# EAGLE design coil-driver-2 (EAGLE 4.16)
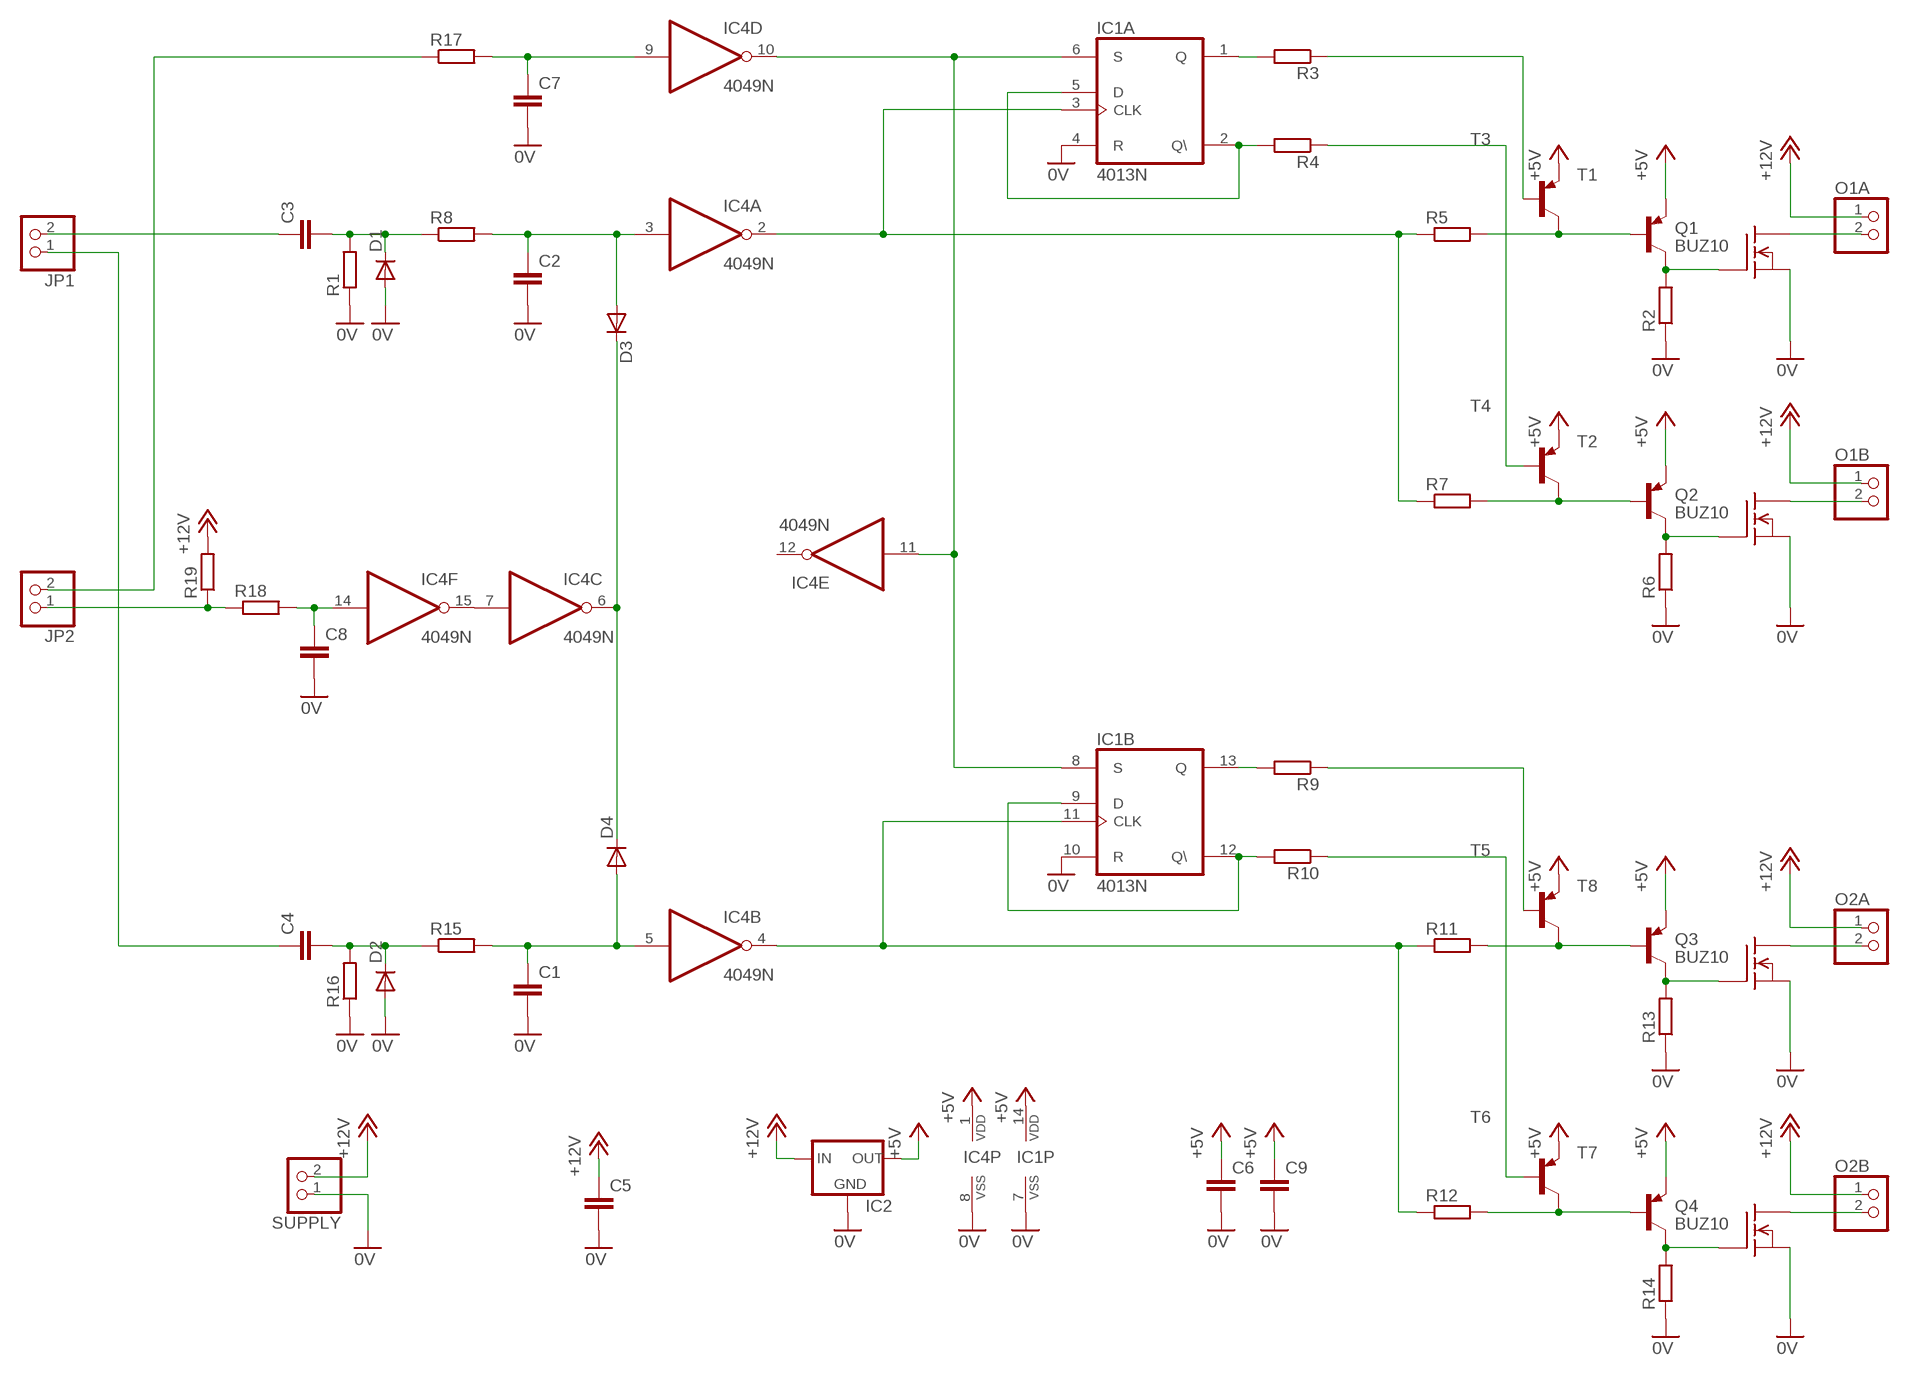
[diagram p0: schematic, sheet 1]

## Parts
C1  C-EU050-030X075  [C050-030X075]
C2  C-EU050-030X075  [C050-030X075]
C3  C-EU050-030X075  [C050-030X075]
C4  C-EU050-030X075  [C050-030X075]
C5  C-EU050-030X075  [C050-030X075]
C6  C-EU050-030X075  [C050-030X075]
C7  C-EU050-030X075  [C050-030X075]
C8  C-EU050-030X075  [C050-030X075]
C9  C-EU050-030X075  [C050-030X075]
D1  DIODE-D-7.5  [D-7.5]
D2  DIODE-D-7.5  [D-7.5]
D3  DIODE-D-7.5  [D-7.5]
D4  DIODE-D-7.5  [D-7.5]
IC1  4013N  [DIL14]
IC2  78XXL  [78XXL]
IC4  4049N  [DIL16]
JP1  PINHD-1X2  [1X02]
JP2  PINHD-1X2  [1X02]
O1A  PINHD-1X2  [1X02]
O1B  PINHD-1X2  [1X02]
O2A  PINHD-1X2  [1X02]
O2B  PINHD-1X2  [1X02]
Q1  BUZ10  [TO220]
Q2  BUZ10  [TO220]
Q3  BUZ10  [TO220]
Q4  BUZ10  [TO220]
R1  R-EU_0207/7  [0207/7]
R2  R-EU_0207/7  [0207/7]
R3  R-EU_0207/7  [0207/7]
R4  R-EU_0207/7  [0207/7]
R5  R-EU_0207/7  [0207/7]
R6  R-EU_0207/7  [0207/7]
R7  R-EU_0207/7  [0207/7]
R8  R-EU_0207/7  [0207/7]
R9  R-EU_0207/7  [0207/7]
R10  R-EU_0207/7  [0207/7]
R11  R-EU_0207/7  [0207/7]
R12  R-EU_0207/7  [0207/7]
R13  R-EU_0207/7  [0207/7]
R14  R-EU_0207/7  [0207/7]
R15  R-EU_0207/7  [0207/7]
R16  R-EU_0207/7  [0207/7]
R17  R-EU_0207/7  [0207/7]
R18  R-EU_0207/7  [0207/7]
R19  R-EU_0207/7  [0207/7]
SUPPLY  PINHD-1X2  [1X02]
T1  BC557B-PNP-TO92-EBC  [TO92-EBC]
T2  BC557B-PNP-TO92-EBC  [TO92-EBC]
T3  BC557B-PNP-TO92-EBC  [TO92-EBC]
T4  BC557B-PNP-TO92-EBC  [TO92-EBC]
T5  BC557B-PNP-TO92-EBC  [TO92-EBC]
T6  BC557B-PNP-TO92-EBC  [TO92-EBC]
T7  BC557B-PNP-TO92-EBC  [TO92-EBC]
T8  BC557B-PNP-TO92-EBC  [TO92-EBC]

## Nets
0V: C1.2 C2.2 C5.2 C6.2 C7.2 C8.2 C9.2 D1.A D2.A IC1.4(A:R) IC1.7(P:VSS) IC1.10(B:R) IC2.GND IC4.8(P:VSS) Q1.3(S) Q2.3(S) Q3.3(S) Q4.3(S) R1.1 R2.1 R6.1 R13.1 R14.1 R16.1 SUPPLY.1
+5V: C6.1 C9.1 IC1.14(P:VDD) IC2.OUT IC4.1(P:VDD) T1.E T2.E T3.E T4.E T5.E T6.E T7.E T8.E
+12V: C5.1 IC2.IN O1A.1 O1B.1 O2A.1 O2B.1 R19.2 SUPPLY.2
N$1: Q1.1(G) R2.2 T1.C
N$2: O1A.2 Q1.2(D)
N$3: IC1.1(A:Q) R3.2
N$4: IC1.2(A:Q\) IC1.5(A:D) R4.2
N$5: R3.1 T3.B
N$6: IC1.3(A:CLK) IC4.2(A:O) R5.1 R7.1
N$7: O1B.2 Q2.2(D)
N$8: C2.1 D3.A IC4.3(A:I) R8.2
N$9: Q2.1(G) R6.2 T2.C
N$10: R4.1 T4.B
N$11: R5.2 T1.B T3.C
N$12: IC1.11(B:CLK) IC4.4(B:O) R11.1 R12.1
N$13: IC1.13(B:Q) R9.2
N$14: R7.2 T2.B T4.C
N$15: C3.2 D1.C R1.2 R8.1
N$16: IC1.9(B:D) IC1.12(B:Q\) R10.2
N$17: R9.1 T5.B
N$18: R10.1 T6.B
N$19: Q3.1(G) R13.2 T8.C
N$20: R11.2 T5.C T8.B
N$21: R12.2 T6.C T7.B
N$22: Q4.1(G) R14.2 T7.C
N$23: O2B.2 Q4.2(D)
N$24: O2A.2 Q3.2(D)
N$25: C4.2 D2.C R15.1 R16.2
N$26: C1.1 D4.A IC4.5(B:I) R15.2
N$27: C4.1 JP1.1
N$28: C3.1 JP1.2
N$29: IC1.6(A:S) IC1.8(B:S) IC4.10(D:O) IC4.11(E:I)
N$30: C7.1 IC4.9(D:I) R17.2
N$32: JP2.2 R17.1
N$37: IC4.7(C:I) IC4.15(F:O)
N$38: JP2.1 R18.1 R19.1
N$39: C8.1 IC4.14(F:I) R18.2
N$40: D3.C D4.C IC4.6(C:O)
Unconnected: IC4.12(E:O)

## Library data of the parts
C1-C9 = rcl:C-EU: CAPACITOR, European symbol
D1-D4 = diode:DIODE-: DIODE
IC1 = 40xx:4013: Dual D FLIP FLOP, set/reset
IC2 = v-reg:78XXL: VOLTAGE REGULATOR
IC4 = 40xx:4049: Hex inverting BUFFER
JP1 JP2 O1A O1B O2A O2B SUPPLY = pinhead:PINHD-1X2: PIN HEADER
Q1-Q4 = transistor-fet:BUZ10: N-Channel Enhancement MOSFET 50V; 20A; 0,080Ohm
R1-R19 = rcl:R-EU_: RESISTOR, European symbol
T1-T8 = transistor:*-PNP-: PNP Transistror

## Board
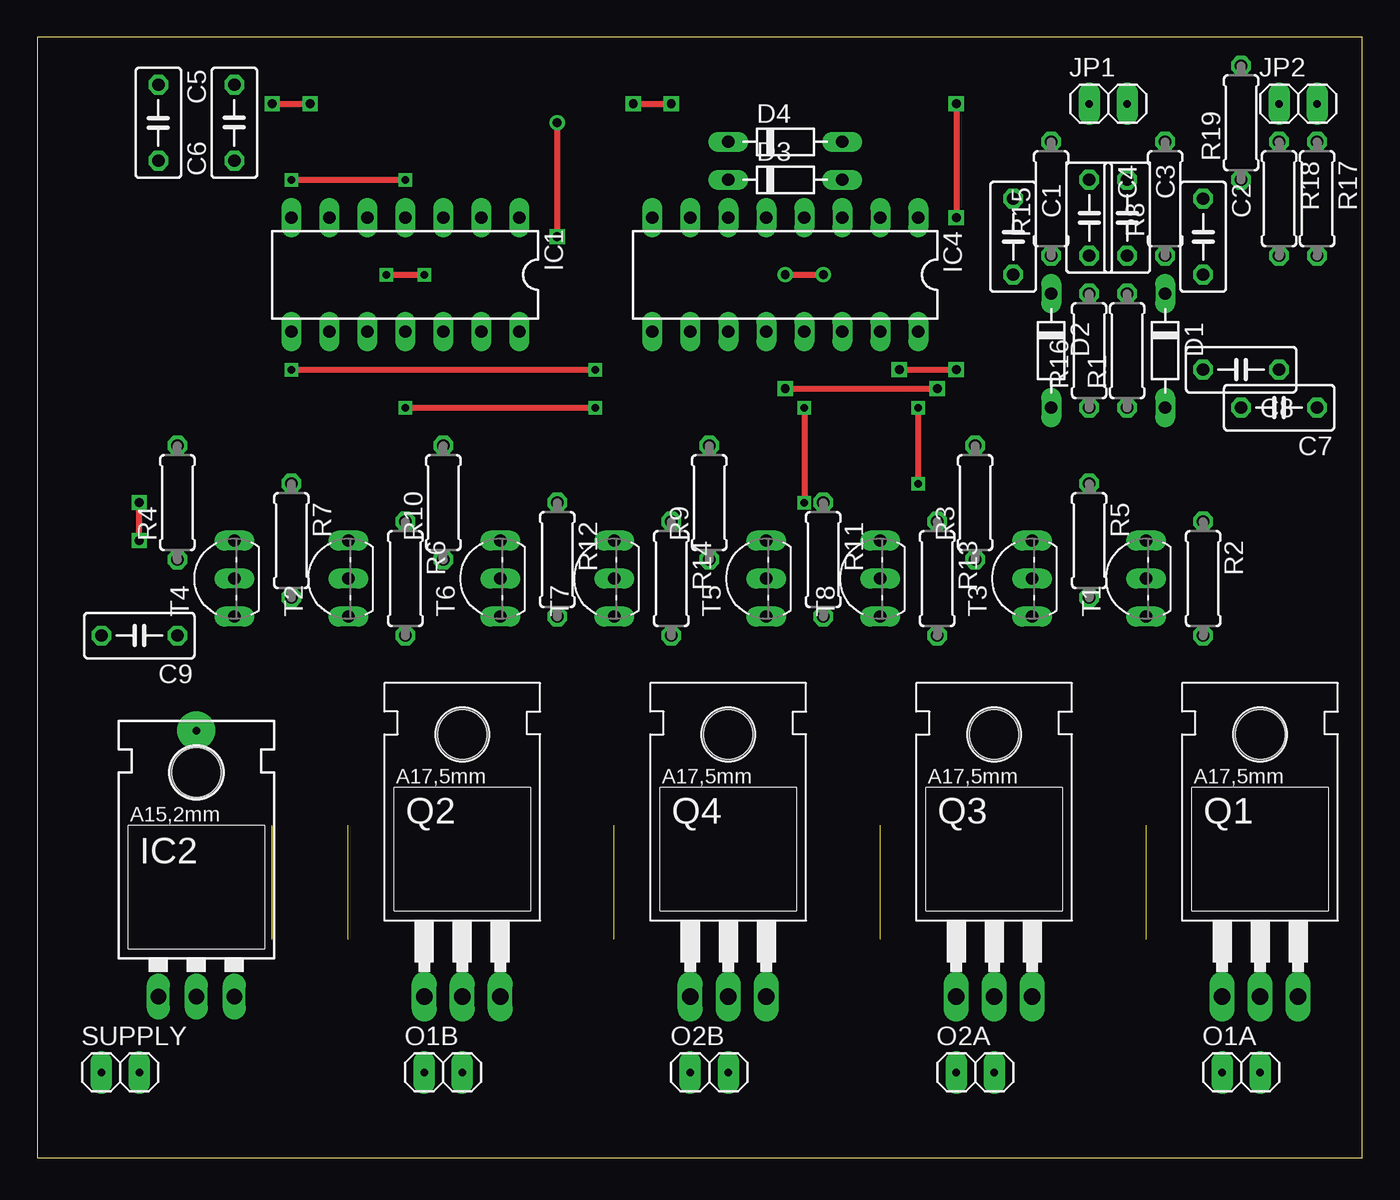
[diagram p1: board, top side]
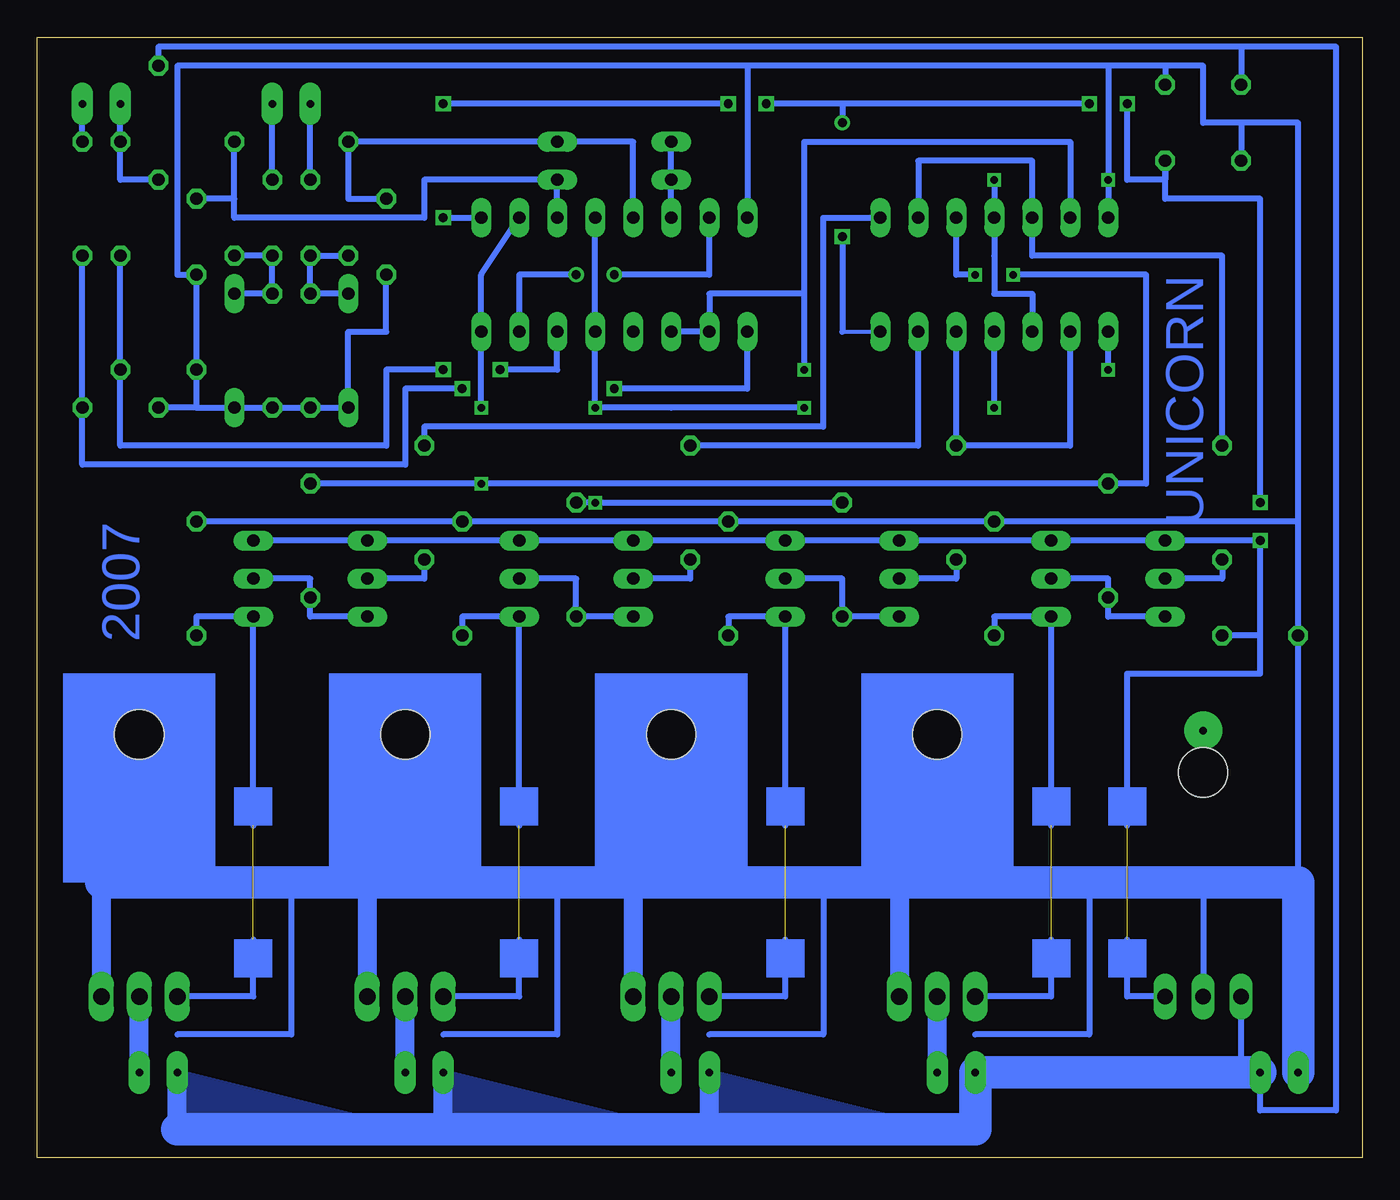
[diagram p2: board, bottom side, seen from below]

Size 88.57 x 74.92 mm. Coordinates in mm from the lower left corner, seen from the top.
Outline: 0,0 88.57,0 88.57,74.92 0,74.92 0,0
Copper layers (1*16): Top 0.035mm / dielectric 1.5mm / Bottom 0.035mm
Design rules "default": minimum track width 10mil, minimum drill 24mil, track to track 8mil, track to pad 8mil, pad to pad 8mil, via to via 8mil, smd to smd 8mil, copper to edge 40mil, drill to drill 8mil, minimum pad ring 10mil, minimum via ring 8mil, stop-mask expansion 4mil, vias tented up to drill 0mil, thermal gap 10mil

### Footprints (pad centres in the part's own frame; a part is rotated, then mirrored left to right if it is on the bottom)
C050-030X075 = drill 0.813 octagon: 1 -2.54,0; 2 2.54,0
D-7.5 = drill 0.813 long: A 3.81,0; C -3.81,0
DIL14 = drill 0.813 long: 1 -7.62,-3.81; 2 -5.08,-3.81; 3 -2.54,-3.81; 4 0,-3.81; 5 2.54,-3.81; 6 5.08,-3.81; 7 7.62,-3.81; 8 7.62,3.81; 9 5.08,3.81; 10 2.54,3.81; 11 0,3.81; 12 -2.54,3.81; 13 -5.08,3.81; 14 -7.62,3.81
78XXL = drill 1.016 long: GND 0,-3.81; IN -2.54,-3.81; OUT 2.54,-3.81 | hole 3.302: 0,11.176
DIL16 = drill 0.813 long: 1 -8.89,-3.81; 2 -6.35,-3.81; 3 -3.81,-3.81; 4 -1.27,-3.81; 5 1.27,-3.81; 6 3.81,-3.81; 7 6.35,-3.81; 8 8.89,-3.81; 9 8.89,3.81; 10 6.35,3.81; 11 3.81,3.81; 12 1.27,3.81; 13 -1.27,3.81; 14 -3.81,3.81; 15 -6.35,3.81; 16 -8.89,3.81
1X02 = drill 0.5 pad 1.422 long: 1 -1.27,0; 2 1.27,0
TO220 = drill 1.118 long: 1 -2.54,-6.35; 2 0,-6.35; 3 2.54,-6.35 | hole 3.302: 0,11.176
0207/7 = drill 0.813 octagon: 1 -3.81,0; 2 3.81,0
TO92-EBC = drill 0.813 long: B 0,-1.27; C -2.54,-1.27; E 2.54,-1.27

### Placement (x,y rotation side)
C1  65.24,61.59 270 top
C2  77.94,61.59 270 top
C3  72.86,62.86 270 top
C4  70.32,62.86 270 top
C5  8.09,69.21 270 top
C6  13.17,69.21 90 top
C7  83.02,50.16 180 top
C8  80.48,52.7 180 top
C9  6.82,34.92 180 top
D1  75.4,53.97 270 top
D2  67.78,53.97 270 top
D3  50,65.4 0 top
D4  50,67.94 0 top
IC1  24.6,59.05 180 top
IC2  10.63,14.6 0 top
IC4  50,59.05 180 top
JP1  71.59,70.48 0 top
JP2  84.29,70.48 0 top
O1A  80.48,5.71 0 top
O1B  27.14,5.71 0 top
O2A  62.7,5.71 0 top
O2B  44.92,5.71 0 top
Q1  81.75,17.14 0 top
Q2  28.41,17.14 0 top
Q3  63.97,17.14 0 top
Q4  46.19,17.14 0 top
R1  72.86,53.97 90 top
R2  77.94,38.73 270 top
R3  62.7,43.81 90 top
R4  9.36,43.81 90 top
R5  70.32,41.27 270 top
R6  24.6,38.73 270 top
R7  16.98,41.27 270 top
R8  75.4,64.13 90 top
R9  44.92,43.81 90 top
R10  27.14,43.81 90 top
R11  52.54,40 270 top
R12  34.76,40 270 top
R13  60.16,38.73 270 top
R14  42.38,38.73 270 top
R15  67.78,64.13 90 top
R16  70.32,53.97 90 top
R17  85.56,64.13 270 top
R18  83.02,64.13 270 top
R19  80.48,69.21 90 top
SUPPLY  5.55,5.71 0 top
T1  72.86,38.73 90 top
T2  19.52,38.73 90 top
T3  65.24,38.73 90 top
T4  11.9,38.73 90 top
T5  47.46,38.73 90 top
T6  29.68,38.73 90 top
T7  37.3,38.73 90 top
T8  55.08,38.73 90 top

### Tracks (layer width: path | path; a pad name or v marks a point on that pad's centre or on a via)
0V  (via drill 0.5)
  Top 0.406: v16.98,65.4 v24.6,65.4
  Bottom 0.406: R2.1 R13.1 R14.1 R6.1 4.28,42.54 | 10.63,18.41 IC2.GND | 16.98,73.02 v16.98,65.4 IC1.7 | 41.11,73.02 IC4.8 | 16.98,73.02 41.11,73.02 | v24.6,65.4 IC1.4 24.6,60.32 24.6,57.78 22.06,57.78 IC1.10 | C1.2 65.24,55.24 67.78,55.24 D2.A R16.1 R1.1 D1.A 77.94,50.16 | C8.2 77.94,50.16 | C2.2 C8.2 | 43.65,8.25 36.03,8.25 36.03,18.41 | 61.43,8.25 53.81,8.25 53.81,18.41 | 79.21,8.25 71.59,8.25 71.59,18.41 | 25.87,8.25 18.25,8.25 18.25,18.41 | C2.2 C8.2 | 8.09,69.21 4.28,69.21 4.28,42.54 | 8.09,69.21 10.63,69.21 10.63,73.02 13.17,73.02 | 4.28,18.41 C9.2 | C9.2 4.28,42.54 | 77.94,50.16 C7.2 | C2.2 77.94,50.16 | C2.2 79.21,59.05 79.21,73.02 41.11,73.02 | 13.17,73.02 C6.2 | 13.17,73.02 16.98,73.02 | SUPPLY.1 C9.2 | 8.09,69.21 C5.2
  Bottom 1.27: 84.29,18.41 Q1.3 | 30.95,18.41 Q2.3 | 48.73,18.41 Q4.3 | 66.51,18.41 Q3.3
  Bottom 2.184: SUPPLY.1 4.28,18.41 10.63,18.41 18.25,18.41 30.95,18.41 36.03,18.41 48.73,18.41 53.81,18.41 66.51,18.41 71.59,18.41 84.29,18.41
+5V  (via drill 0.6)  (1 unrouted)
  Top 0.406: v61.43,70.48 v61.43,62.86 | v39.84,70.48 v42.38,70.48 | v34.76,69.21 v34.76,61.59 | v15.71,70.48 v18.25,70.48 | v6.82,41.27 v6.82,43.81
  Bottom 0.254: 34.76,55.24 IC1.14
  Bottom 0.406: T1.E T3.E T8.E T5.E T7.E T6.E T2.E T4.E v6.82,41.27 6.82,34.92 | v61.43,62.86 IC4.1 | IC2.OUT 15.71,10.79 15.71,14.6 | 15.71,22.22 15.71,32.38 6.82,32.38 6.82,34.92 | v42.38,70.48 v61.43,70.48 | 34.76,70.48 v39.84,70.48 | v34.76,61.59 34.76,55.24 | 34.76,70.48 v34.76,69.21 | v18.25,70.48 34.76,70.48 | v15.71,70.48 15.71,65.4 13.17,65.4 C6.1 13.17,64.13 6.82,64.13 v6.82,43.81 | 6.82,34.92 C9.1
+12V
  Bottom 0.406: 8.09,5.71 IC2.IN | SUPPLY.2 6.82,3.17 1.74,3.17 1.74,74.29 8.09,74.29 | 8.09,74.29 80.48,74.29 R19.2 | 8.09,74.29 C5.1
  Bottom 1.27: 43.65,1.9 O2B.1 | 61.43,1.9 O2A.1 | 79.21,1.9 O1A.1
  Bottom 2.184: SUPPLY.2 8.09,5.71 O1B.1 25.87,1.9 43.65,1.9 61.43,1.9 79.21,1.9
  pour Bottom (no thermals): 28.41,1.9 43.65,5.71 43.65,1.9
  pour Bottom (no thermals): 63.97,1.9 79.21,5.71 79.21,1.9
  pour Bottom (no thermals): 46.19,1.9 61.43,5.71 61.43,1.9
N$1  (1 unrouted)
  Bottom 0.406: 74.13,22.22 T1.C 77.94,36.19 R2.2 | Q1.1 74.13,10.79 74.13,14.6
N$2
  Bottom 1.27: O1A.2 Q1.2
N$3
  Bottom 0.406: R3.2 62.7,48.89 36.03,48.89 36.03,62.86 IC1.1
N$4
  Bottom 0.406: R4.2 9.36,60.32 22.06,60.32 IC1.5 22.06,66.67 29.68,66.67 IC1.2
N$5
  Bottom 0.406: T3.B 62.7,38.73 R3.1
N$6  (via drill 0.5)
  Top 0.406: v58.89,45.08 v58.89,50.16 | v23.33,59.05 v25.87,59.05
  Bottom 0.406: R5.1 v58.89,45.08 R7.1 14.44,45.08 14.44,59.05 v23.33,59.05 | IC1.3 27.14,59.05 v25.87,59.05 | IC4.2 58.89,59.05 v58.89,50.16
N$7
  Bottom 1.27: O1B.2 Q2.2
N$8
  Bottom 0.406: IC4.3 D3.A 62.7,65.4 62.7,62.86 75.4,62.86 75.4,64.13 | 75.4,64.13 R8.2 | 75.4,64.13 C2.1
N$9  (1 unrouted)
  Bottom 0.406: 20.79,22.22 T2.C 24.6,36.19 R6.2 | Q2.1 20.79,10.79 20.79,14.6
N$10
  Bottom 0.406: T4.B 9.36,38.73 R4.1
N$11
  Bottom 0.406: T3.C 70.32,36.19 R5.2 70.32,38.73 T1.B
N$12  (via drill 0.5)
  Top 0.406: v51.27,50.16 v51.27,43.81 | v24.6,50.16 v37.3,50.16
  Bottom 0.406: R12.1 v51.27,43.81 R11.1 | v24.6,50.16 IC1.11 | v37.3,50.16 46.19,50.16 v51.27,50.16 IC4.4
N$13
  Bottom 0.406: R9.2 29.68,47.62 IC1.13
N$14
  Bottom 0.406: T4.C 16.98,36.19 R7.2 16.98,38.73 T2.B
N$15
  Bottom 0.406: D1.C R1.2 C3.2 R8.1
N$16
  Bottom 0.406: IC1.9 19.52,47.62 R10.2 IC1.12
N$17
  Bottom 0.406: T5.B 44.92,38.73 R9.1
N$18
  Bottom 0.406: R10.1 27.14,38.73 T6.B
N$19  (1 unrouted)
  Bottom 0.406: 56.35,22.22 T8.C 60.16,36.19 R13.2 | Q3.1 56.35,10.79 56.35,14.6
N$20
  Bottom 0.406: T5.C R11.2 52.54,38.73 T8.B
N$21
  Bottom 0.406: T6.C R12.2 34.76,38.73 T7.B
N$22  (1 unrouted)
  Bottom 0.406: 38.57,22.22 T7.C 42.38,36.19 R14.2 | Q4.1 38.57,10.79 38.57,14.6
N$23
  Bottom 1.27: O2B.2 Q4.2
N$24
  Bottom 1.27: O2A.2 Q3.2
N$25
  Bottom 0.406: D2.C R16.2 C4.2 R15.1
N$26
  Bottom 0.406: IC4.5 48.73,67.94 D4.A R15.2 67.78,64.13 C1.1
N$27
  Bottom 0.406: C4.1 JP1.1
N$28
  Bottom 0.406: C3.1 JP1.2
N$29  (via drill 0.5)
  Top 0.406: v16.98,52.7 v37.3,52.7
  Bottom 0.406: 37.3,57.78 37.3,67.94 19.52,67.94 IC1.6 | v37.3,52.7 37.3,57.78 | v16.98,52.7 IC1.8 | 37.3,57.78 43.65,57.78 IC4.10 IC4.11
N$30  (via drill 0.6)
  Top 0.406: v50,51.43 v60.16,51.43
  Bottom 0.406: IC4.9 41.11,51.43 v50,51.43 | v60.16,51.43 63.97,51.43 63.97,46.35 85.56,46.35 C7.1 R17.2
N$31  (via drill 0.5 pad 2.54)
  other vias: 28.41,28.57
N$32
  Bottom 0.406: R17.1 JP2.2
N$33  (via drill 0.5 pad 2.54)
  other vias: 46.19,28.57
N$34  (via drill 0.5 pad 2.54)
  other vias: 63.97,28.57
N$35  (via drill 0.5 pad 2.54)
  other vias: 81.75,28.57
N$36  (via drill 0.5 pad 2.54)
  other vias: 10.63,28.57
N$37  (via drill 0.6)
  Top 0.406: v50,59.05 v52.54,59.05
  Bottom 0.406: IC4.15 56.35,59.05 v52.54,59.05 | v50,59.05 43.65,59.05 IC4.7
N$38
  Bottom 0.406: JP2.1 R18.1 83.02,65.4 R19.1
N$39  (via drill 0.6)
  Top 0.406: v57.62,52.7 v61.43,52.7
  Bottom 0.406: IC4.14 53.81,52.7 v57.62,52.7 | R18.2 C8.1 83.02,47.62 65.24,47.62 65.24,52.7 v61.43,52.7
N$40
  Bottom 0.406: IC4.6 D3.C D4.C
(copper drawn outside any net)
  shapes: Bottom area x14

### Text on the board
Bottom: UNICORN | 2007